# EasyEDA schematic tanaBoard.json

## Sheets
1 Peripherals: TITLE: Peripherals; REV: 1.0; Date: 2022-02-18; Sheet: 1/1; Drawn By: Rodney Osodo; Company: Rodney Osodo
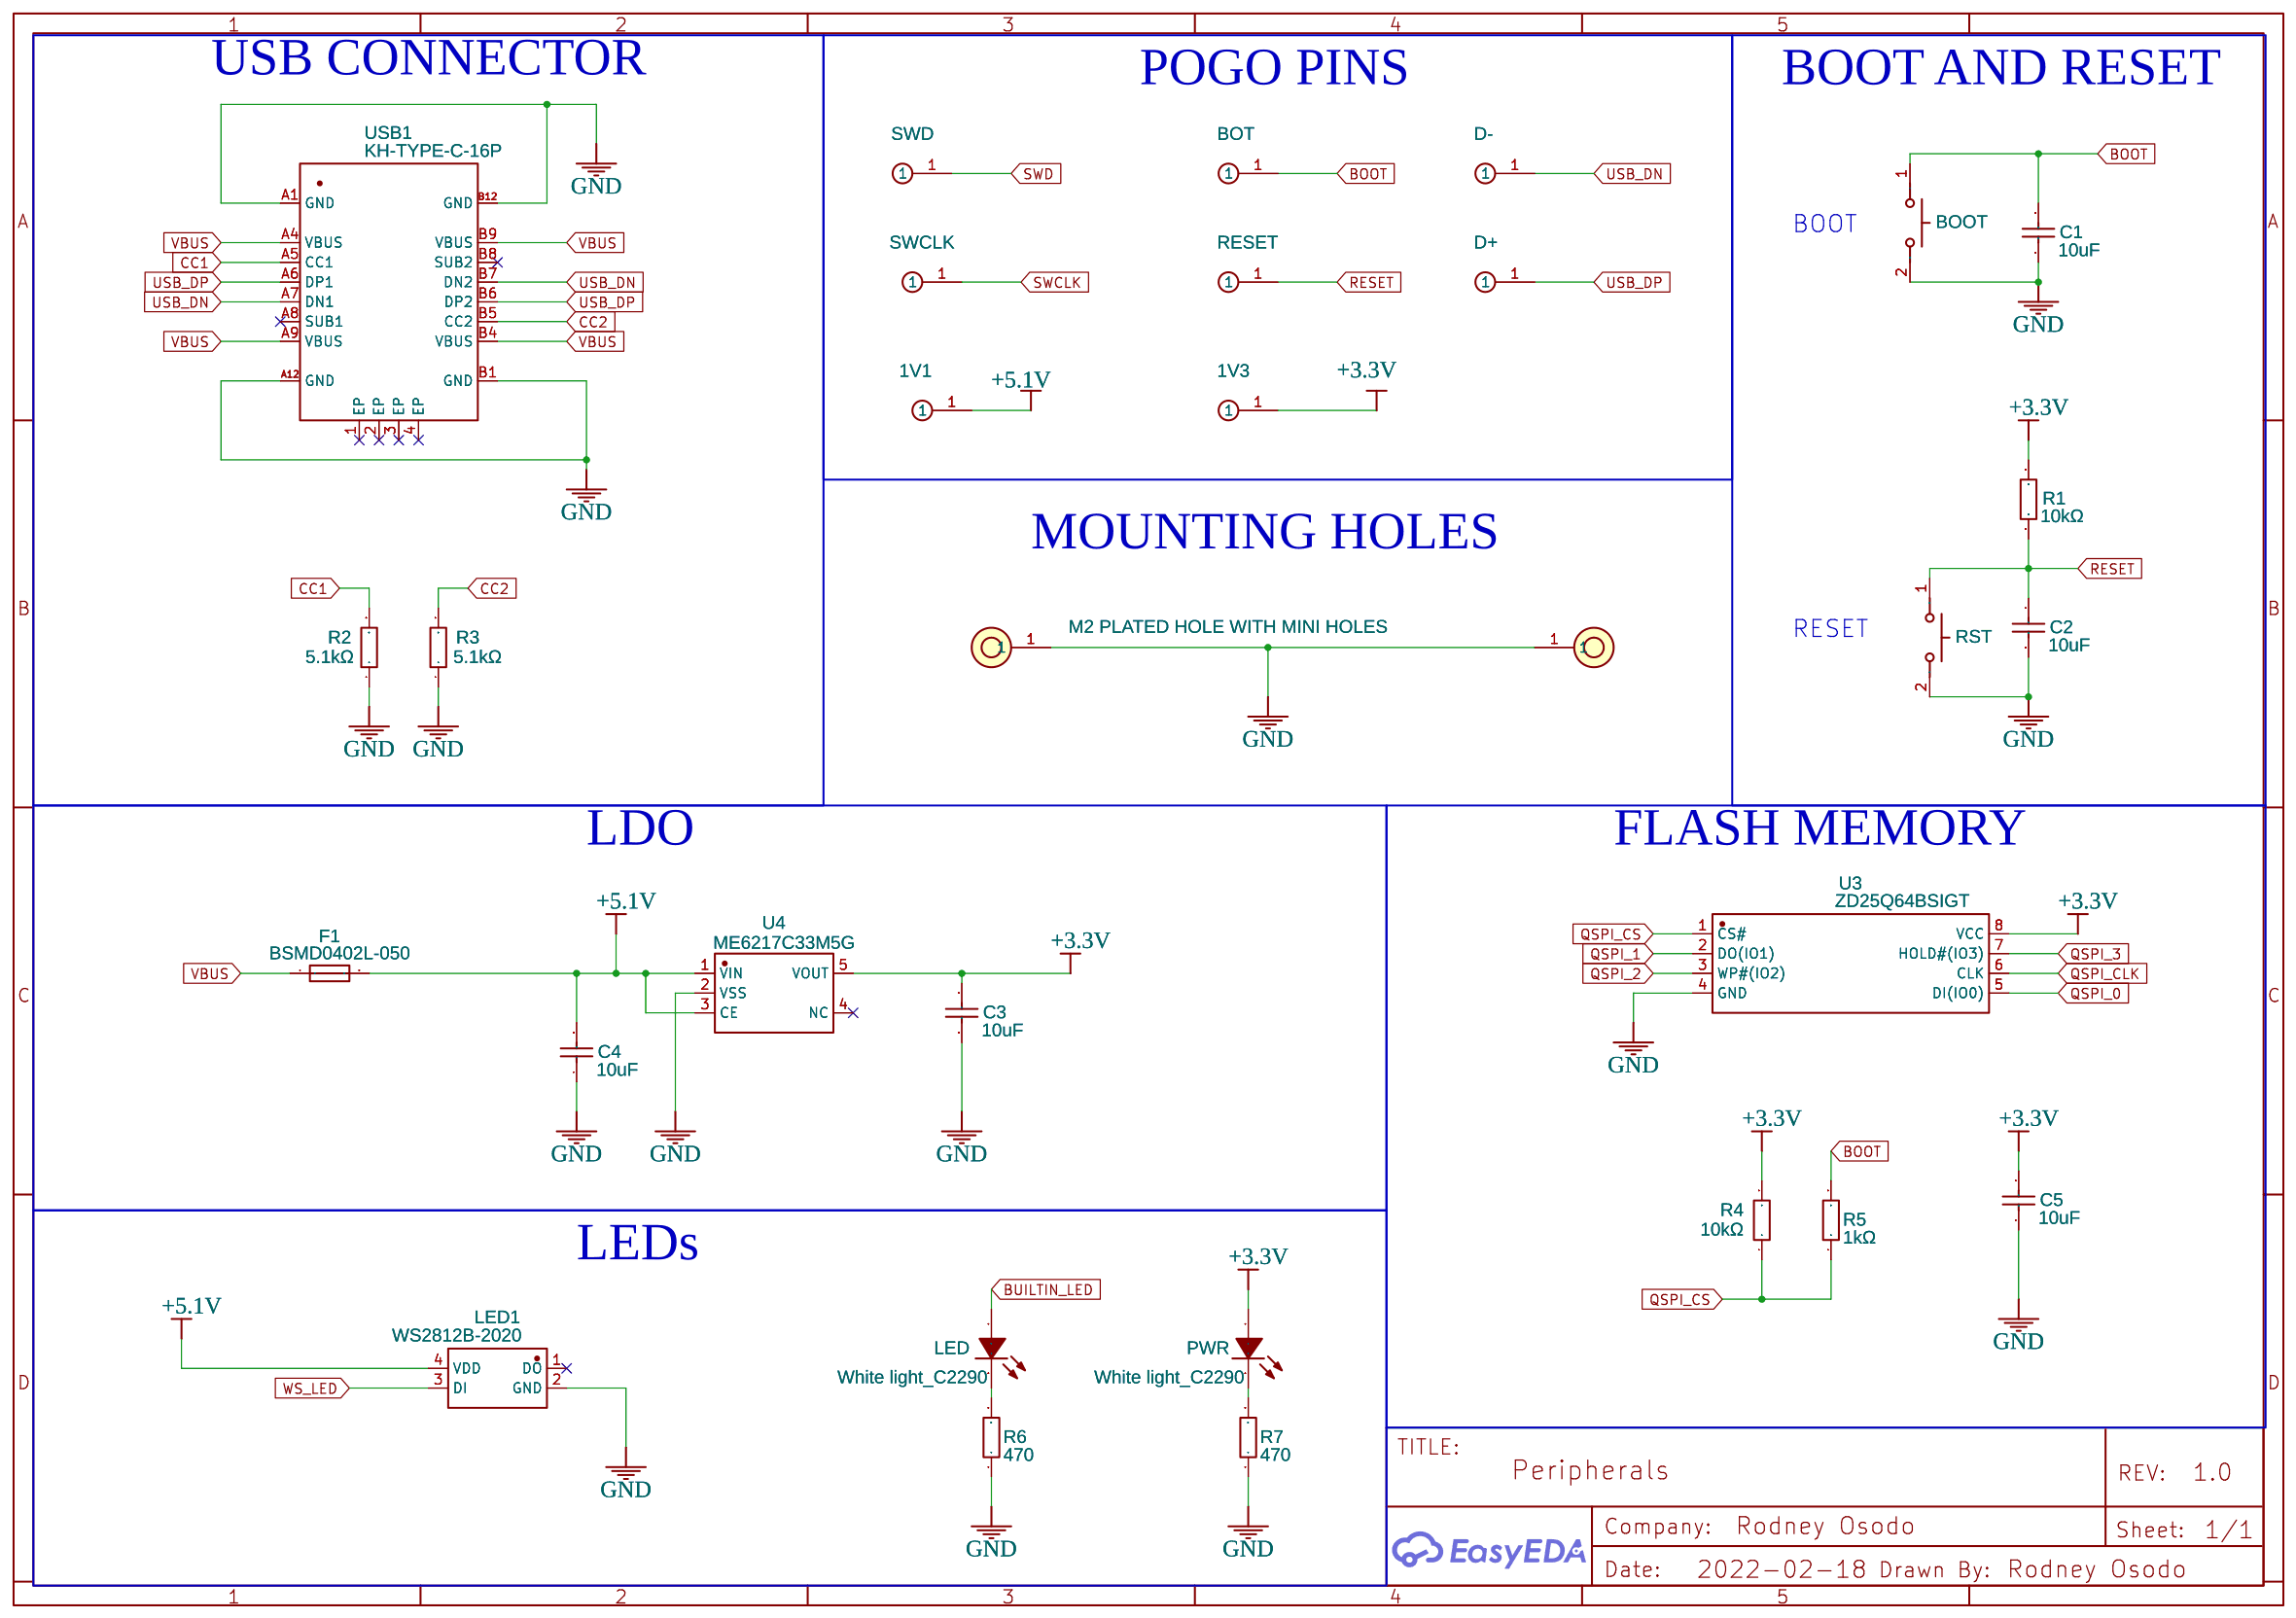
[diagram p0: Peripherals]
2 MCU: TITLE: MCU
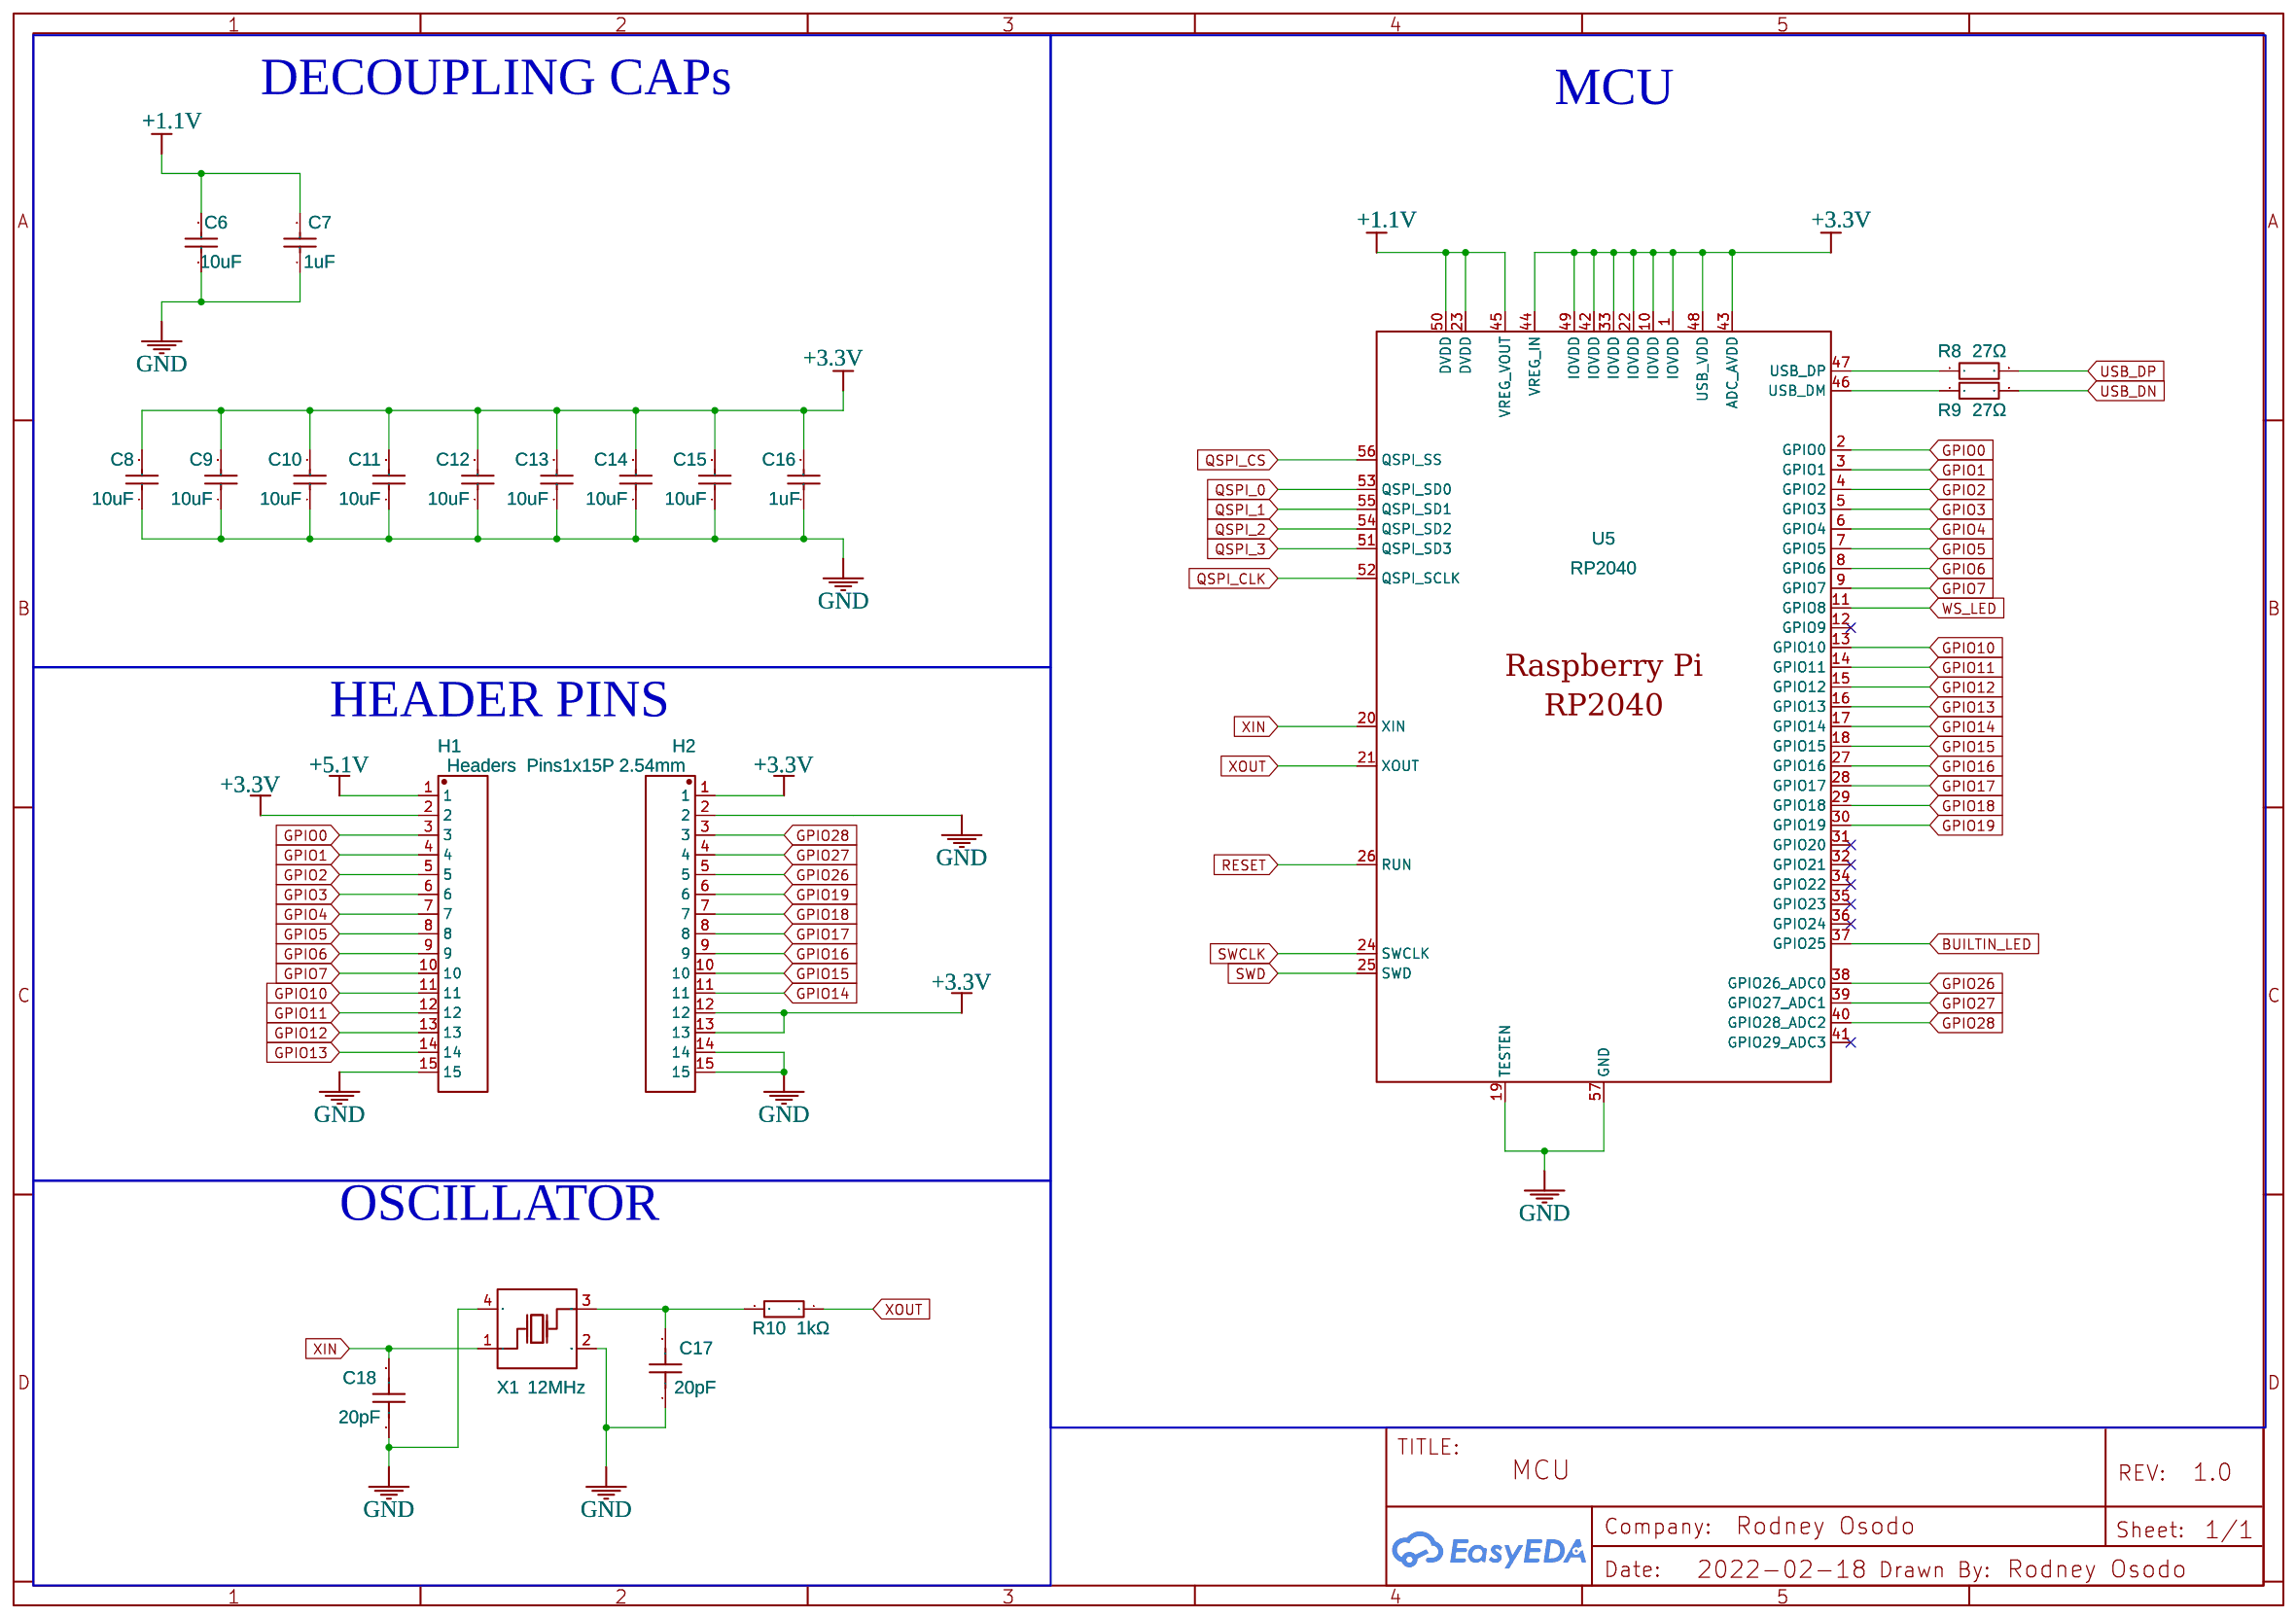
[diagram p1: MCU]

## Parts
sheet MCU
C6  10uF  [C0402]
C7  1uF  [C0402]
C8  10uF  [C0402]
C9  10uF  [C0402]
C10  10uF  [C0402]
C11  10uF  [C0402]
C12  10uF  [C0402]
C13  10uF  [C0402]
C14  10uF  [C0402]
C15  10uF  [C0402]
C16  1uF  [C0402]
C17  20pF  [C0402]
C18  20pF  [C0402]
H1  Headers  Pins1x15P 2.54mm  [HDR-TH_15P-P2.54-V-M]
H2  Headers  Pins1x15P 2.54mm  [HDR-TH_15P-P2.54-V-M]
R8  27Ω  [R0402]
R9  27Ω  [R0402]
R10  1kΩ  [R0402]
U5  RP2040  [LQFN-56_L7.0-W7.0-P0.4-EP]
X1  12MHz  [OSC-SMD_4P-L3.2-W2.5-BL]
sheet Peripherals
1V1  testpoint  [TESTPAD]
1V3  testpoint  [TESTPAD]
BOOT  SKRKAEE020  [SW-SMD_L3.9-W3.0-P4.45]
BOT  testpoint  [TESTPAD]
C1  10uF  [C0402]
C2  10uF  [C0402]
C3  10uF  [C0402]
C4  10uF  [C0402]
C5  10uF  [C0402]
D+  testpoint  [TESTPAD]
D-  testpoint  [TESTPAD]
F1  BSMD0402L-050  [F0402]
LED  White light_C2290  [LED0603-R-RD_WHITE]
LED1  WS2812B-2020  [LED-SMD_4P-L2.0-W2.0-TL_WS2812B-2020]
PWR  White light_C2290  [LED0603-R-RD_WHITE]
R1  10kΩ  [R0402]
R2  5.1kΩ  [R0402]
R3  5.1kΩ  [R0402]
R4  10kΩ  [R0402]
R5  1kΩ  [R0402]
R6  470  [R0402]
R7  470  [R0402]
RESET  testpoint  [TESTPAD]
RST  SKRKAEE020  [SW-SMD_L3.9-W3.0-P4.45]
SWCLK  testpoint  [TESTPAD]
SWD  testpoint  [TESTPAD]
U1  M2 PLATED HOLE WITH MINI HOLES  [M2 PLATED HOLE WITH MINI HOLES]
U2  M2 PLATED HOLE WITH MINI HOLES  [M2 PLATED HOLE WITH MINI HOLES]
U3  ZD25Q64BSIGT  [SOP-8_L5.3-W5.3-P1.27-LS8.0-BL]
U4  ME6217C33M5G  [SOT-23-5_L3.0-W1.7-P0.95-LS2.8-BR]
USB1  KH-TYPE-C-16P  [USB-C-SMD_KH-TYPE-C-16P]

## Library data of the parts
C1-C6 C8-C15 = CL05A106MQ5NUNC: Supplier: LCSC; Manufacturer: SAMSUNG; Supplier Part: C15525; JLCPCB Part Class: Basic Part
C7 C16 = CL05A105KP5NNNC: Supplier: LCSC; Manufacturer: SAMSUNG; Supplier Part: C14445; JLCPCB Part Class: Extended Part
C17 C18 = 0402CG200F500NT: Supplier: LCSC; Supplier Part: C182483; Manufacturer: Guangdong Fenghua Advanced Tech; Contributor: LCSC; JLCPCB Part Class: Extended Part
H1 H2 = Headers  Pins1x15P 2.54mm: Supplier Part: C54102; Supplier: LCSC; Manufacturer: ReliaPro
R8 R9 = RC-02W27R0FT: Supplier: LCSC; Supplier Part: C321419; Manufacturer: Guangdong Fenghua Advanced Tech; Resistance (Ohms): 27; Contributor: LCSC
R5 R10 = RC-02W1001FT: Supplier: LCSC; Supplier Part: C226166; Manufacturer: Guangdong Fenghua Advanced Tech; Resistance (Ohms): 1K; Contributor: LCSC; JLCPCB Part Class: Extended Part
U5 = RP2040: Supplier: LCSC; Supplier Part: C2040; Manufacturer: Raspberry Pi(树莓派); JLCPCB Part Class: Extended Part; Contributor: LCSC
X1 = X322512MSB4SI: Supplier: LCSC; Manufacturer: YXC; Supplier Part: C9002; JLCPCB Part Class: Basic Part
1V1 1V3 BOT D+ D- RESET SWCLK SWD = testpoint: Contributor: magnus östgren
BOOT RST = SKRKAEE020: Supplier: LCSC; Manufacturer: ALPS; Supplier Part: C115357; JLCPCB Part Class: Extended Part
F1 = BSMD0402L-050: Supplier: LCSC; Supplier Part: C914087; Manufacturer: BHFUSE; Contributor: LCSC; JLCPCB Part Class: Extended Part
LED PWR = 0603White light_C2290: Supplier: LCSC; Manufacturer: KENTO; Manufacturer Part: 0603White light; Supplier Part: C2290; JLCPCB Part Class: Basic Part
LED1 = WS2812B-2020: Supplier: LCSC; Supplier Part: C965555; Manufacturer: Worldsemi; Contributor: LCSC; JLCPCB Part Class: Extended Part
R1 R4 = RC-02W1002FT: Supplier: LCSC; Supplier Part: C258091; Manufacturer: Guangdong Fenghua Advanced Tech; Resistance (Ohms): 10K; Contributor: LCSC; JLCPCB Part Class: Extended Part
R2 R3 = RC-02W5101FT: Supplier: LCSC; Supplier Part: C294638; Manufacturer: Guangdong Fenghua Advanced Tech; Resistance (Ohms): 5.1K; Contributor: LCSC
R6 R7 = RC0402FR-07470RL: Supplier: LCSC; Manufacturer: YAGEO; Supplier Part: C114877; JLCPCB Part Class: Extended Part; Resistance: 470Ω
U1 U2 = M2 PLATED HOLE WITH MINI HOLES: Contributor: Andrew Young
U3 = ZD25Q64BSIGT: Supplier: LCSC; Supplier Part: C2687407; Manufacturer: Zetta(澜智); Contributor: LCSC; JLCPCB Part Class: Extended Part
U4 = ME6217C33M5G: Supplier: LCSC; Supplier Part: C427602; Manufacturer: Nanjing Micro One Elec; Contributor: LCSC; JLCPCB Part Class: Extended Part
USB1 = KH-TYPE-C-16P: Supplier: LCSC; Supplier Part: C709357; Manufacturer: Shenzhen Kinghelm Elec; Contributor: LCSC; JLCPCB Part Class: Extended Part

## Nets
+1.1V: C6.2 C7.2 U5.23(DVDD) U5.45(VREG_VOUT) U5.50(DVDD)
+3.3V: 1V3.1 C3.2 C5.2 C8.2 C9.2 C10.2 C11.2 C12.2 C13.2 C14.2 C15.2 C16.2 H1.2 H2.1 H2.12 H2.13 PWR.1(A) R1.2 R4.2 U3.8(VCC) U4.5(VOUT) U5.1(IOVDD) U5.10(IOVDD) U5.22(IOVDD) U5.33(IOVDD) U5.42(IOVDD) U5.43(ADC_AVDD) U5.44(VREG_IN) U5.48(USB_VDD) U5.49(IOVDD)
+5.1V: 1V1.1 C4.2 F1.2 H1.1 LED1.4(VDD) U4.1(VIN) U4.3(CE)
GND: BOOT.2 C1.2 C2.2 C3.1 C4.1 C5.1 C6.1 C7.1 C8.1 C9.1 C10.1 C11.1 C12.1 C13.1 C14.1 C15.1 C16.1 C17.1 C18.1 H1.15 H2.2 H2.14 H2.15 LED1.2(GND) R2.1 R3.1 R6.1 R7.1 RST.2 U1.1 U2.1 U3.4(GND) U4.2(VSS) U5.19(TESTEN) U5.57(GND) USB1.A1(GND) USB1.A12(GND) USB1.B1(GND) USB1.B12(GND) X1.2(GND) X1.4(GND)
VBUS: F1.1 USB1.A4(VBUS) USB1.A9(VBUS) USB1.B4(VBUS) USB1.B9(VBUS)
BOOT: BOOT.1 BOT.1 C1.1 R5.2
BUILTIN_LED: LED.1(A) U5.37(GPIO25)
CC1: R2.2 USB1.A5(CC1)
CC2: R3.2 USB1.B5(CC2)
GPIO0: H1.3 U5.2(GPIO0)
GPIO1: H1.4 U5.3(GPIO1)
GPIO2: H1.5 U5.4(GPIO2)
GPIO3: H1.6 U5.5(GPIO3)
GPIO4: H1.7 U5.6(GPIO4)
GPIO5: H1.8 U5.7(GPIO5)
GPIO6: H1.9 U5.8(GPIO6)
GPIO7: H1.10 U5.9(GPIO7)
GPIO10: H1.11 U5.13(GPIO10)
GPIO11: H1.12 U5.14(GPIO11)
GPIO12: H1.13 U5.15(GPIO12)
GPIO13: H1.14 U5.16(GPIO13)
GPIO14: H2.11 U5.17(GPIO14)
GPIO15: H2.10 U5.18(GPIO15)
GPIO16: H2.9 U5.27(GPIO16)
GPIO17: H2.8 U5.28(GPIO17)
GPIO18: H2.7 U5.29(GPIO18)
GPIO19: H2.6 U5.30(GPIO19)
GPIO26: H2.5 U5.38(GPIO26_ADC0)
GPIO27: H2.4 U5.39(GPIO27_ADC1)
GPIO28: H2.3 U5.40(GPIO28_ADC2)
QSPI_0: U3.5(DI(IO0)) U5.53(QSPI_SD0)
QSPI_1: U3.2(DO(IO1)) U5.55(QSPI_SD1)
QSPI_2: U3.3(WP#(IO2)) U5.54(QSPI_SD2)
QSPI_3: U3.7(HOLD#(IO3)) U5.51(QSPI_SD3)
QSPI_CLK: U3.6(CLK) U5.52(QSPI_SCLK)
QSPI_CS: R4.1 R5.1 U3.1(CS#) U5.56(QSPI_SS)
RESET: C2.1 R1.1 RESET.1 RST.1 U5.26(RUN)
SWCLK: SWCLK.1 U5.24(SWCLK)
SWD: SWD.1 U5.25(SWD)
USB_DN: D-.1 R9.2 USB1.A7(DN1) USB1.B7(DN2)
USB_DP: D+.1 R8.2 USB1.A6(DP1) USB1.B6(DP2)
WS_LED: LED1.3(DI) U5.11(GPIO8)
XIN: C18.2 U5.20(XIN) X1.1(OSC1)
XOUT: R10.1 U5.21(XOUT)
Net-(C17-2): C17.2 R10.2 X1.3(OSC2)
Net-(LED-2): LED.2(K) R6.2
Net-(PWR-2): PWR.2(K) R7.2
Net-(R8-1): R8.1 U5.47(USB_DP)
Net-(R9-1): R9.1 U5.46(USB_DM)

Not connected (* = marked no-connect by the designer): LED1 1(DO)*; U4 4(NC)*; U5 12(GPIO9)* 31(GPIO20)* 32(GPIO21)* 34(GPIO22)* 35(GPIO23)* 36(GPIO24)* 41(GPIO29_ADC3)*; USB1 1(EP)* 2(EP)* 3(EP)* 4(EP)* A8(SUB1)* B8(SUB2)*

## Notes on the sheets
sheet 1
- USB CONNECTOR
- POGO PINS
- BOOT AND RESET
- BOOT
- MOUNTING HOLES
- RESET
- LDO
- FLASH MEMORY
- LEDs
sheet 2
- DECOUPLING CAPs
- MCU
- HEADER PINS
- OSCILLATOR
